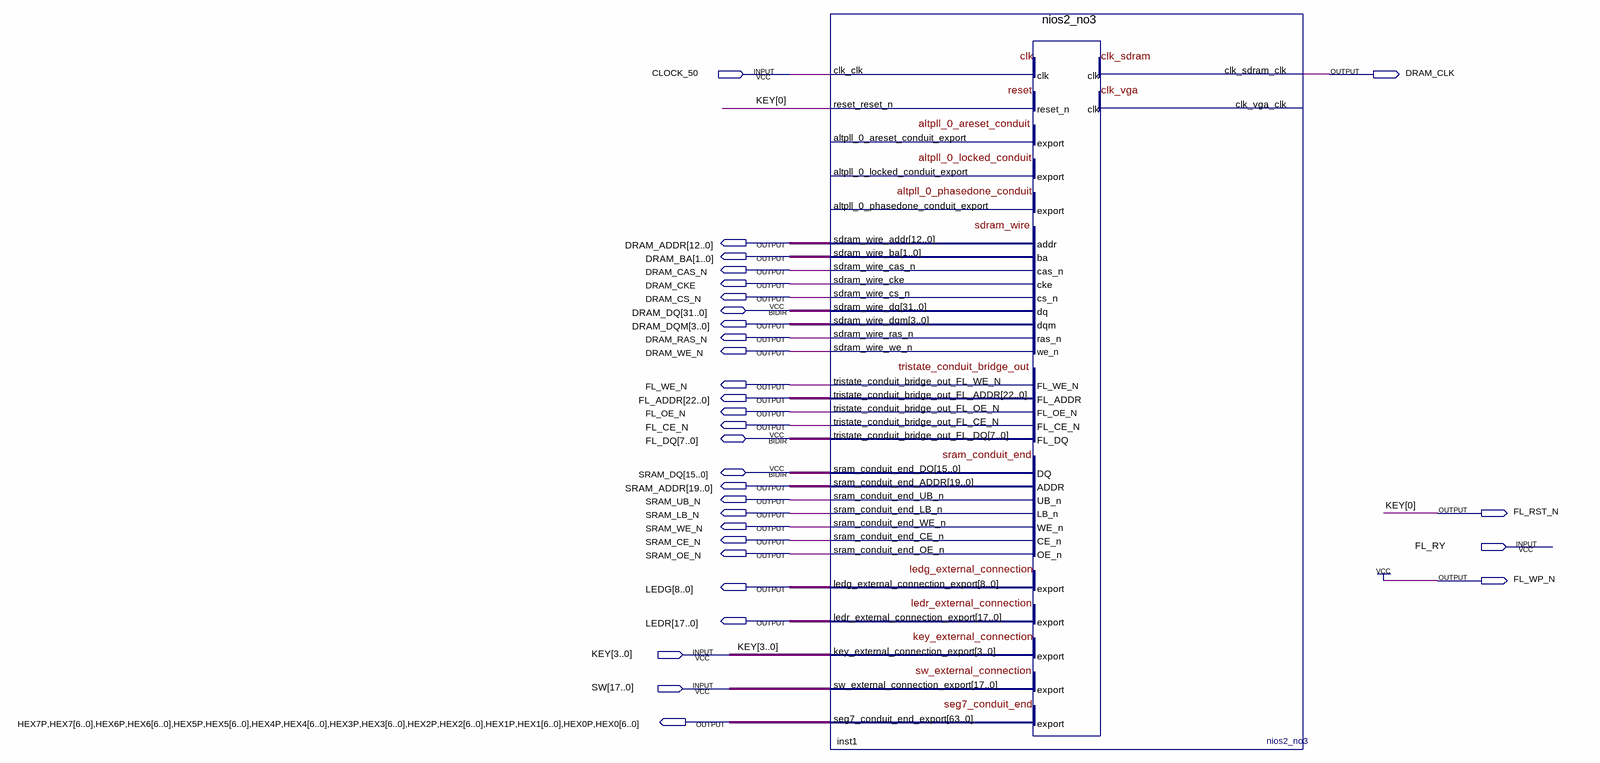
[diagram p0: schematic sheet]
// Quartus schematic ex8_1.bdf as structural Verilog: 1 symbols, 31 pins
module ex8_1 (
  input  CLOCK_50,
  input  FL_RY,
  input  [3:0] KEY,
  input  [17:0] SW,
  inout  [31:0] DRAM_DQ,
  inout  [7:0] FL_DQ,
  inout  [15:0] SRAM_DQ,
  output DRAM_CLK,
  output [12:0] DRAM_ADDR,
  output [1:0] DRAM_BA,
  output DRAM_CAS_N,
  output DRAM_CKE,
  output DRAM_CS_N,
  output [3:0] DRAM_DQM,
  output DRAM_RAS_N,
  output DRAM_WE_N,
  output FL_WE_N,
  output [22:0] FL_ADDR,
  output FL_OE_N,
  output FL_CE_N,
  output [19:0] SRAM_ADDR,
  output SRAM_UB_N,
  output SRAM_LB_N,
  output FL_RST_N,
  output SRAM_WE_N,
  output SRAM_CE_N,
  output SRAM_OE_N,
  output FL_WP_N,
  output [8:0] LEDG,
  output [17:0] LEDR,
  output HEX7P,
  output [6:0] HEX7,
  output HEX6P,
  output [6:0] HEX6,
  output HEX5P,
  output [6:0] HEX5,
  output HEX4P,
  output [6:0] HEX4,
  output HEX3P,
  output [6:0] HEX3,
  output HEX2P,
  output [6:0] HEX2,
  output HEX1P,
  output [6:0] HEX1,
  output HEX0P,
  output [6:0] HEX0
);

  nios2_no3 inst1 (
    .clk_clk(CLOCK_50), .reset_reset_n(KEY[0]), .key_external_connection_export(KEY),
    .sw_external_connection_export(SW), .clk_sdram_clk(DRAM_CLK), .sdram_wire_addr(DRAM_ADDR),
    .sdram_wire_ba(DRAM_BA), .sdram_wire_cas_n(DRAM_CAS_N), .sdram_wire_cke(DRAM_CKE),
    .sdram_wire_cs_n(DRAM_CS_N), .sdram_wire_dqm(DRAM_DQM), .sdram_wire_ras_n(DRAM_RAS_N),
    .sdram_wire_we_n(DRAM_WE_N), .tristate_conduit_bridge_out_FL_WE_N(FL_WE_N),
    .tristate_conduit_bridge_out_FL_ADDR(FL_ADDR), .tristate_conduit_bridge_out_FL_OE_N(FL_OE_N),
    .tristate_conduit_bridge_out_FL_CE_N(FL_CE_N), .sram_conduit_end_ADDR(SRAM_ADDR),
    .sram_conduit_end_UB_n(SRAM_UB_N), .sram_conduit_end_LB_n(SRAM_LB_N), .sram_conduit_end_WE_n(SRAM_WE_N),
    .sram_conduit_end_CE_n(SRAM_CE_N), .sram_conduit_end_OE_n(SRAM_OE_N),
    .ledg_external_connection_export(LEDG), .ledr_external_connection_export(LEDR),
    .seg7_conduit_end_export({HEX7P, HEX7, HEX6P, HEX6, HEX5P, HEX5, HEX4P, HEX4, HEX3P, HEX3, HEX2P, HEX2, HEX1P, HEX1, HEX0P, HEX0}),
    .sdram_wire_dq(DRAM_DQ), .tristate_conduit_bridge_out_FL_DQ(FL_DQ), .sram_conduit_end_DQ(SRAM_DQ));  // open: altpll_0_areset_conduit_export, clk_vga_clk, altpll_0_locked_conduit_export, altpll_0_phasedone_conduit_export

  assign FL_RST_N = KEY[0];
  assign FL_WP_N = 1'b1;
endmodule
